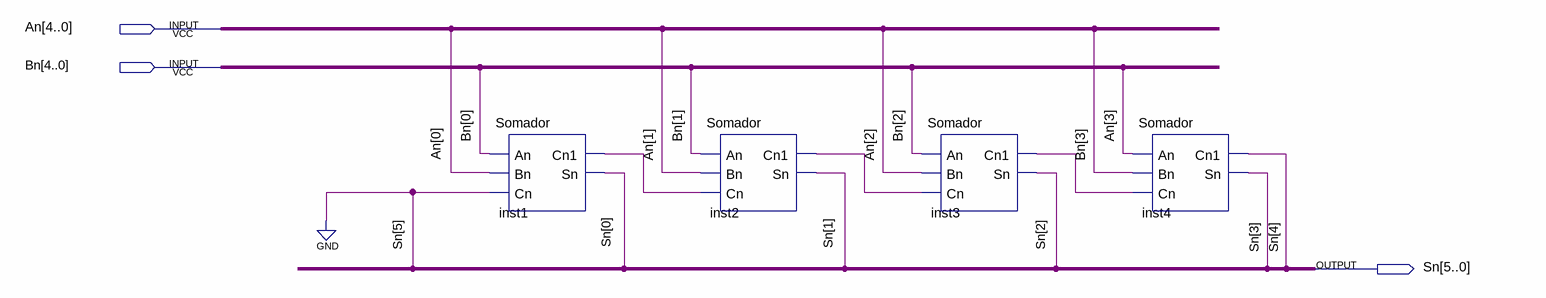
[diagram p0: schematic sheet]
// Quartus schematic SomadorCompleto.bdf as structural Verilog: 4 symbols, 3 pins
module SomadorCompleto (
  input  [4:0] An,
  input  [4:0] Bn,
  output [5:0] Sn
);

  wire inst1_cn1, inst2_cn1, inst3_cn1;

  Somador inst1 (.An(Bn[0]), .Bn(An[0]), .Cn(1'b0), .Cn1(inst1_cn1), .Sn(Sn[0]));
  Somador inst2 (.An(Bn[1]), .Bn(An[1]), .Cn(inst1_cn1), .Cn1(inst2_cn1), .Sn(Sn[1]));
  Somador inst3 (.An(Bn[2]), .Bn(An[2]), .Cn(inst2_cn1), .Cn1(inst3_cn1), .Sn(Sn[2]));
  Somador inst4 (.An(An[3]), .Bn(Bn[3]), .Cn(inst3_cn1), .Cn1(Sn[4]), .Sn(Sn[3]));

  assign Sn[5] = 1'b0;
endmodule
